# EAGLE design ProgShield (EAGLE 6.2)
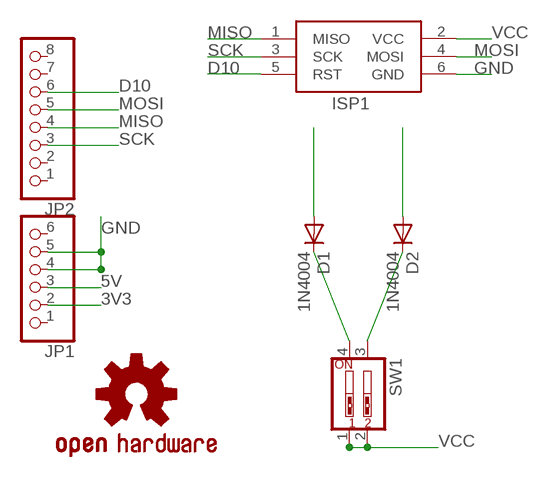
[diagram p0: schematic, sheet 1]

## Parts
D1  1N4004  [DO41-10]
D2  1N4004  [DO41-10]
ISP1  AVRISP-6  [AVRISP]
JP1  PINHD-1X6CB  [1X06-CLEANBIG]
JP2  PINHD-1X8CLEANBIG  [1X08-CLEANBIG]
SW1  SW_DIP-2  [EDG-02]
U$1  OSHW-LOGOL  [OSHW-LOGO-L]

## Nets
3V3: D2.A JP1.2
5V: D1.A JP1.3
D10: ISP1.5(RST) JP2.6
GND: ISP1.6(GND) JP1.4 JP1.5
MISO: ISP1.1(MISO) JP2.4
MOSI: ISP1.4(MOSI) JP2.5
N$2: D1.C SW1.4
N$3: D2.C SW1.3
SCK: ISP1.3(SCK) JP2.3
VCC: ISP1.2(VCC) SW1.1 SW1.2
Unconnected: JP1.1 JP1.6 JP2.1 JP2.2 JP2.7 JP2.8

## Library data of the parts
D1 D2 = adafruit:1N4004: DIODE General purpose 1N400x type rectifier (With bigger pads) http://www.ladyada.net/library/pcb/eaglelibrary.html
ISP1 = adafruit:AVRISP: AVR ISP HEADER Standard 6 pin header for AVR programming
JP1 = adafruit:PINHD-1X6: PIN HEADER
JP2 = adafruit:PINHD-1X8: PIN HEADER
SW1 = special:SW_DIP-2: DIP SWITCH
U$1 = SparkFun-Aesthetics:OSHW-LOGO: Open Source Hardware Logo This logo indicates the piece of hardware it is found on incorporates a OSHW license and/or adheres to the definition of open source hardware found here: http://freedomdefined.org/OSHW

## Board
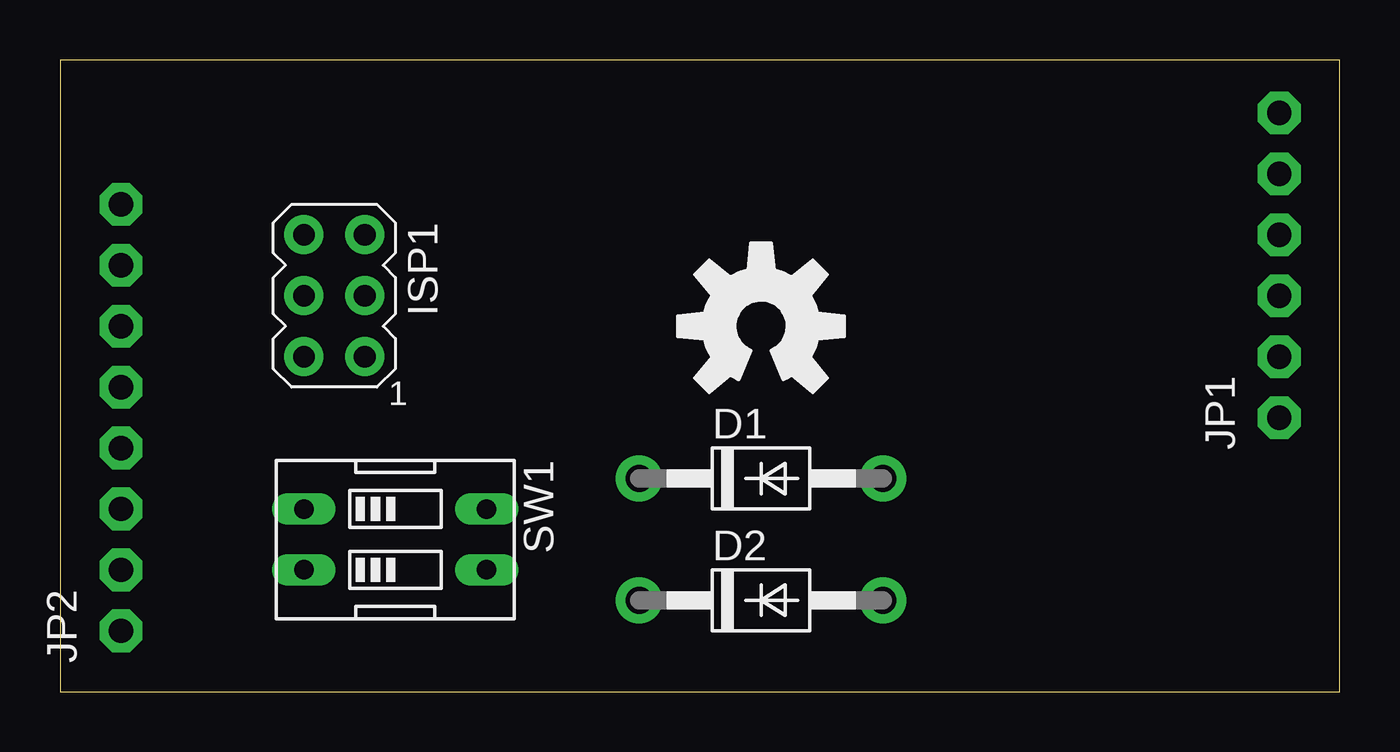
[diagram p1: board, top side]
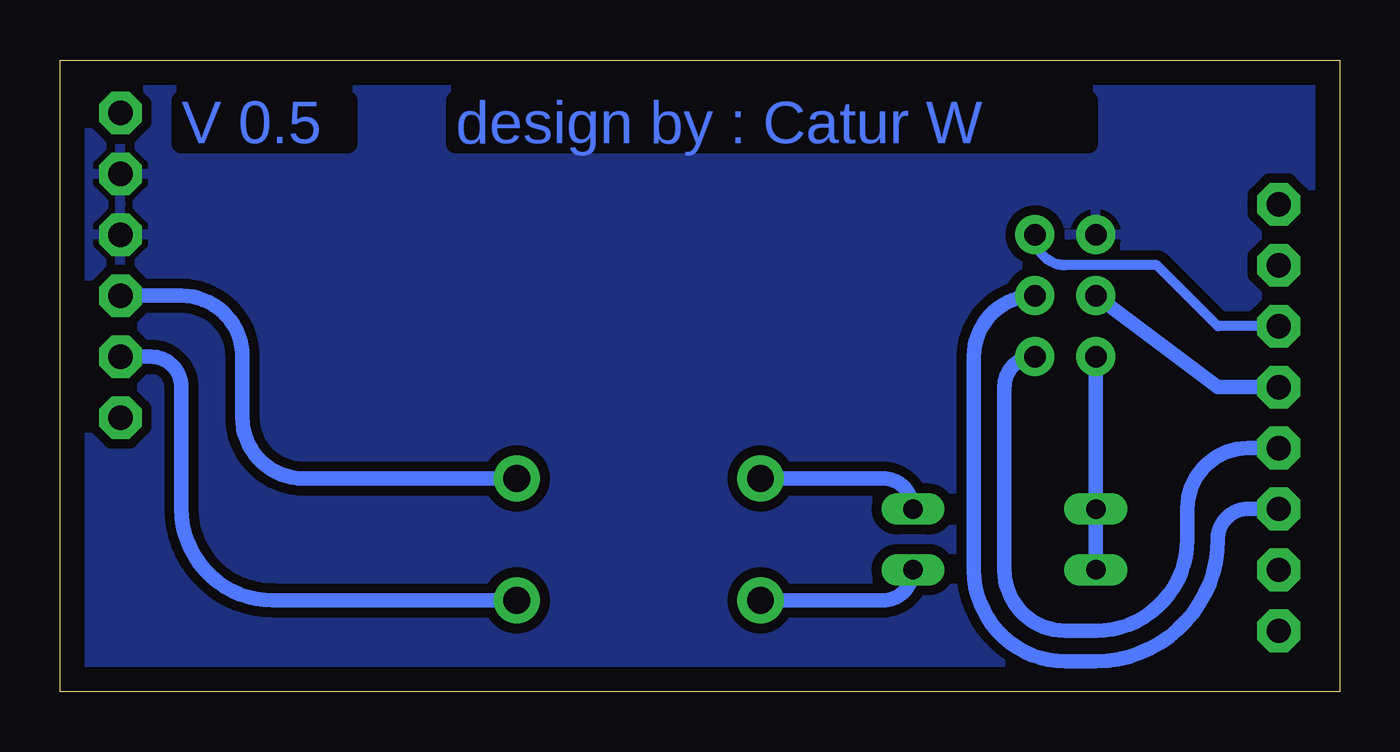
[diagram p2: board, bottom side, seen from below]

Size 53.32 x 26.34 mm. Coordinates in mm from the lower left corner, seen from the top.
Outline: 0,0 53.32,0 53.32,26.34 0,26.34 0,0
Copper layers (1*16): Top 0.035mm / dielectric 1.5mm / Bottom 0.035mm
Design rules: minimum track width 10mil, minimum drill 24mil, track to track 8mil, track to pad 8mil, pad to pad 8mil, via to via 8mil, smd to smd 8mil, copper to edge 40mil, drill to drill 8mil, minimum pad ring 10mil, minimum via ring 8mil, stop-mask expansion 4mil, vias tented up to drill 0mil, thermal gap 10mil

### Footprints (pad centres in the part's own frame; a part is rotated, then mirrored left to right if it is on the bottom)
DO41-10 = drill 1.118 pad 1.93: A 5.08,0; C -5.08,0
AVRISP = drill 0.9 pad 1.626: 1 -1.27,2.54; 2 1.27,2.54; 3 -1.27,0; 4 1.27,0; 5 -1.27,-2.54; 6 1.27,-2.54
1X06-CLEANBIG = drill 1.016 pad 1.778 octagon: 1 -6.35,0; 2 -3.81,0; 3 -1.27,0; 4 1.27,0; 5 3.81,0; 6 6.35,0
1X08-CLEANBIG = drill 1.016 pad 1.778 octagon: 1 -8.89,0; 2 -6.35,0; 3 -3.81,0; 4 -1.27,0; 5 1.27,0; 6 3.81,0; 7 6.35,0; 8 8.89,0
EDG-02 = drill 0.813 long: 1 -1.27,-3.81; 2 1.27,-3.81; 3 1.27,3.81; 4 -1.27,3.81

### Placement (x,y rotation side)
D1  29.21,8.89 0 top
D2  29.21,3.81 0 top
ISP1  11.43,16.51 180 top
JP1  50.8,17.78 90 top
JP2  2.54,11.43 90 top
SW1  13.97,6.35 270 top
U$1  29.21,15.24 0 top

### Tracks (layer width: path | path; a pad name or v marks a point on that pad's centre or on a via)
3V3
  Bottom 0.61: JP1.2 49.53,13.97 arc90 48.26,12.7 48.26,7.62 arc-90 44.45,3.81 D2.A
5V
  Bottom 0.61: JP1.3 48.26,16.51 arc90 45.72,13.97 45.72,11.43 arc-90 43.18,8.89 D1.A
D10
  Bottom 0.406: JP2.6 5.08,15.24 7.62,17.78 11.43,17.78 arc90 ISP1.5
GND
  pour Bottom (isolate 0.406): 0,25.4 0,0 53.34,0 53.34,25.4
MISO
  Bottom 0.61: JP2.4 3.81,10.16 arc-90 6.35,7.62 6.35,6.35 arc90 10.16,2.54 11.43,2.54 arc90 13.97,5.08 13.97,12.7 arc90 ISP1.1
MOSI
  Bottom 0.61: JP2.5 5.08,12.7 ISP1.4
N$2
  Bottom 0.61: D1.C 19.05,8.89 arc90 SW1.4
N$3
  Bottom 0.61: D2.C 19.05,3.81 arc-90 SW1.3
SCK
  Bottom 0.61: JP2.3 3.81,7.62 arc-90 5.08,6.35 arc90 10.16,1.27 11.43,1.27 arc90 15.24,5.08 15.24,13.97 arc90 ISP1.3
VCC
  Bottom 0.61: SW1.2 SW1.1 ISP1.2

### Text on the board
Bottom: design by : Catur W | V 0.5